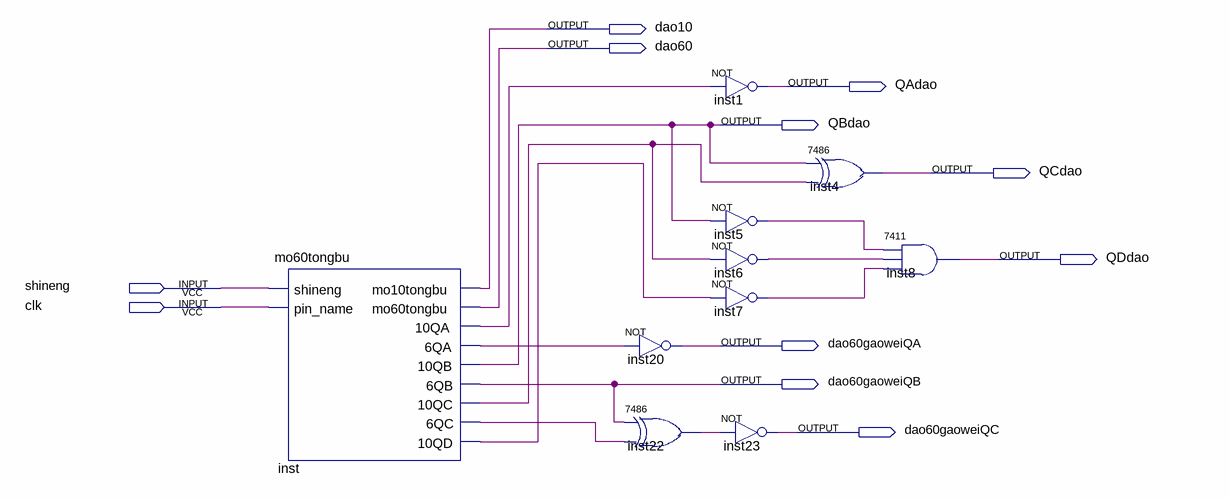
[diagram p0: schematic sheet]
// Quartus schematic daomo60.bdf as structural Verilog: 10 symbols, 11 pins
module daomo60 (
  input  shineng,
  input  clk,
  output dao10,
  output dao60,
  output QAdao,
  output QBdao,
  output QCdao,
  output QDdao,
  output dao60gaoweiQA,
  output dao60gaoweiQB,
  output dao60gaoweiQC
);

  wire inst5_out, inst6_out, inst7_out, inst22_1, inst_6qa, inst_6qc, inst_10qa, inst_10qc, inst_10qd;

  mo60tongbu inst (
    .shineng(shineng), .pin_name(clk), .mo10tongbu(dao10), .mo60tongbu(dao60), .\10QA (inst_10qa),
    .\6QA (inst_6qa), .\10QB (QBdao), .\6QB (dao60gaoweiQB), .\10QC (inst_10qc), .\6QC (inst_6qc),
    .\10QD (inst_10qd));
  not inst20 (dao60gaoweiQA, inst_6qa);
  \7486  inst22 (.\2 (dao60gaoweiQB), .\3 (inst_6qc), .\1 (inst22_1));
  not inst1 (QAdao, inst_10qa);
  not inst5 (inst5_out, QBdao);
  not inst6 (inst6_out, inst_10qc);
  not inst7 (inst7_out, inst_10qd);
  not inst23 (dao60gaoweiQC, inst22_1);
  \7486  inst4 (.\2 (QBdao), .\3 (inst_10qc), .\1 (QCdao));
  \7411  inst8 (.\2 (inst5_out), .\3 (inst6_out), .\4 (inst7_out), .\1 (QDdao));
endmodule
